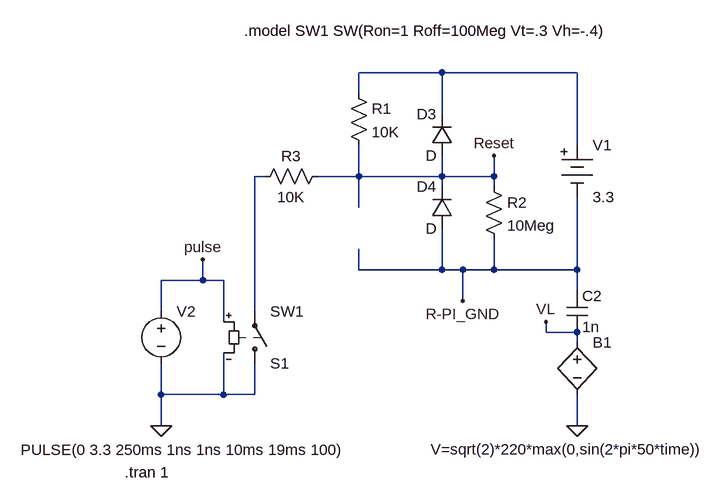
[diagram p0: schematic model.asc]
model.asc, the LTspice schematic file:
Version 4
SHEET 1 972 680
WIRE 240 32 112 32
WIRE 448 32 240 32
WIRE 112 64 112 32
WIRE 240 96 240 32
WIRE 448 144 448 32
WIRE -32 192 -48 192
WIRE 112 192 112 144
WIRE 112 192 48 192
WIRE 240 192 240 160
WIRE 240 192 112 192
WIRE 320 192 320 160
WIRE 320 192 240 192
WIRE 240 208 240 192
WIRE 320 208 320 192
WIRE 112 240 112 192
WIRE 112 336 112 304
WIRE 240 336 240 272
WIRE 240 336 112 336
WIRE 272 336 240 336
WIRE 320 336 320 288
WIRE 320 336 272 336
WIRE 448 336 448 224
WIRE 448 336 320 336
WIRE -128 352 -128 320
WIRE -128 352 -192 352
WIRE -96 352 -128 352
WIRE 448 368 448 336
WIRE 272 384 272 336
WIRE -192 400 -192 352
WIRE -48 400 -48 192
WIRE -96 416 -96 352
WIRE 400 432 400 416
WIRE 448 432 400 432
WIRE 448 448 448 432
WIRE -192 528 -192 480
WIRE -96 528 -96 464
WIRE -96 528 -192 528
WIRE -48 528 -48 480
WIRE -48 528 -96 528
WIRE -192 576 -192 528
WIRE 448 576 448 528
FLAG -192 576 0
FLAG 448 576 0
FLAG 320 160 Reset
FLAG 272 384 R-PI_GND
FLAG -128 320 pulse
FLAG 400 416 VL
SYMBOL diode 256 160 R180
WINDOW 0 24 64 Left 2
WINDOW 3 24 0 Left 2
SYMATTR InstName D3
SYMBOL diode 256 272 R180
WINDOW 0 24 64 Left 2
WINDOW 3 24 0 Left 2
SYMATTR InstName D4
SYMBOL Misc\\battery 448 128 R0
WINDOW 123 0 0 Left 0
WINDOW 39 0 0 Left 0
SYMATTR InstName V1
SYMATTR Value 3.3
SYMBOL res 96 48 R0
SYMATTR InstName R1
SYMATTR Value 10K
SYMBOL res 304 192 R0
SYMATTR InstName R2
SYMATTR Value 10Meg
SYMBOL sw -48 496 M180
SYMATTR InstName S1
SYMATTR Value SW1
SYMBOL voltage -192 384 R0
WINDOW 3 -216 229 Left 2
WINDOW 123 0 0 Left 0
WINDOW 39 0 0 Left 0
SYMATTR Value PULSE(0 3.3 250ms 1ns 1ns 10ms 19ms 100)
SYMATTR InstName V2
SYMBOL res 64 176 R90
WINDOW 0 0 56 VBottom 2
WINDOW 3 32 56 VTop 2
SYMATTR InstName R3
SYMATTR Value 10K
SYMBOL bv 448 432 R0
WINDOW 3 -225 180 Left 2
SYMATTR InstName B1
SYMATTR Value V=sqrt(2)*220*max(0,sin(2*pi*50*time))
SYMBOL cap 432 368 R0
SYMATTR InstName C2
SYMATTR Value 1n
TEXT -248 648 Left 2 !.tran 1
TEXT -64 -32 Left 2 !.model SW1 SW(Ron=1 Roff=100Meg Vt=.3 Vh=-.4)

The netlist it stands for:
* model.asc
D3 Reset N001 D
D4 R-PI_GND Reset D
V1 N001 R-PI_GND 3.3
R1 N001 Reset 10K
R2 Reset R-PI_GND 10Meg
S1 0 N002 pulse 0 SW1
V2 pulse 0 PULSE(0 3.3 250ms 1ns 1ns 10ms 19ms 100)
R3 Reset N002 10K
B1 VL 0 V=sqrt(2)*220*max(0,sin(2*pi*50*time))
C2 R-PI_GND VL 1n
.model D D
.lib standard.dio
.tran 1
.model SW1 SW(Ron=1 Roff=100Meg Vt=.3 Vh=-.4)
.backanno
.end